# EasyEDA Pro project ProPrj_药盒0.11_2025-04-15.epro, board PCB1_1
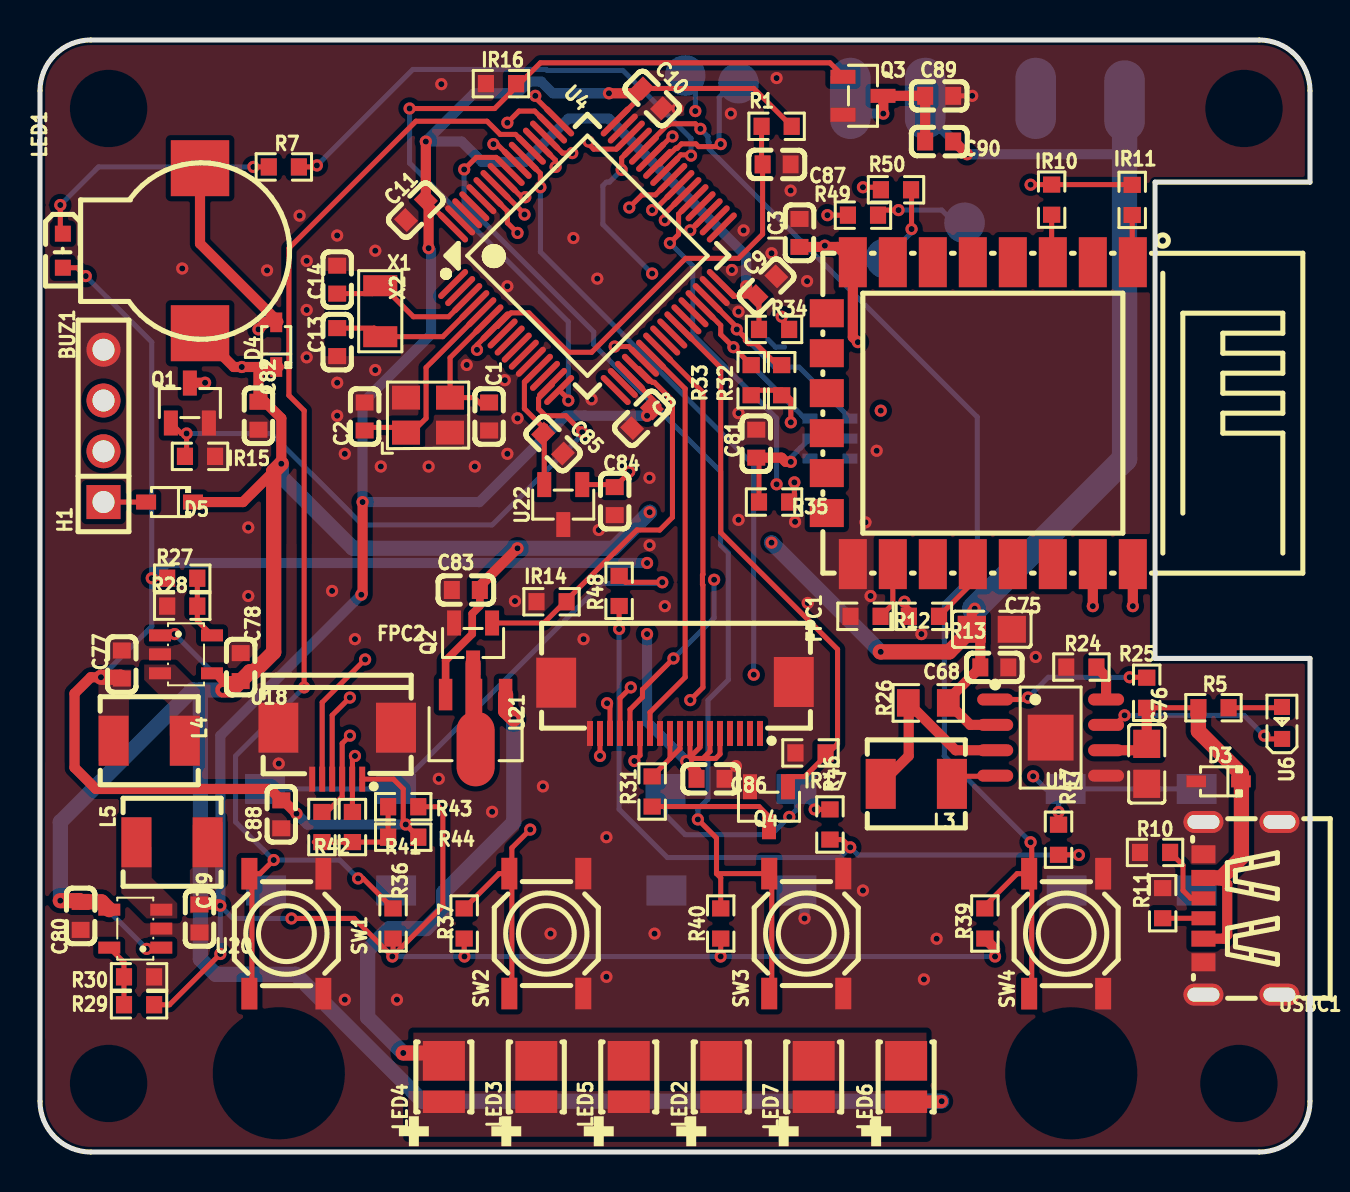
[diagram p7: board, top side]
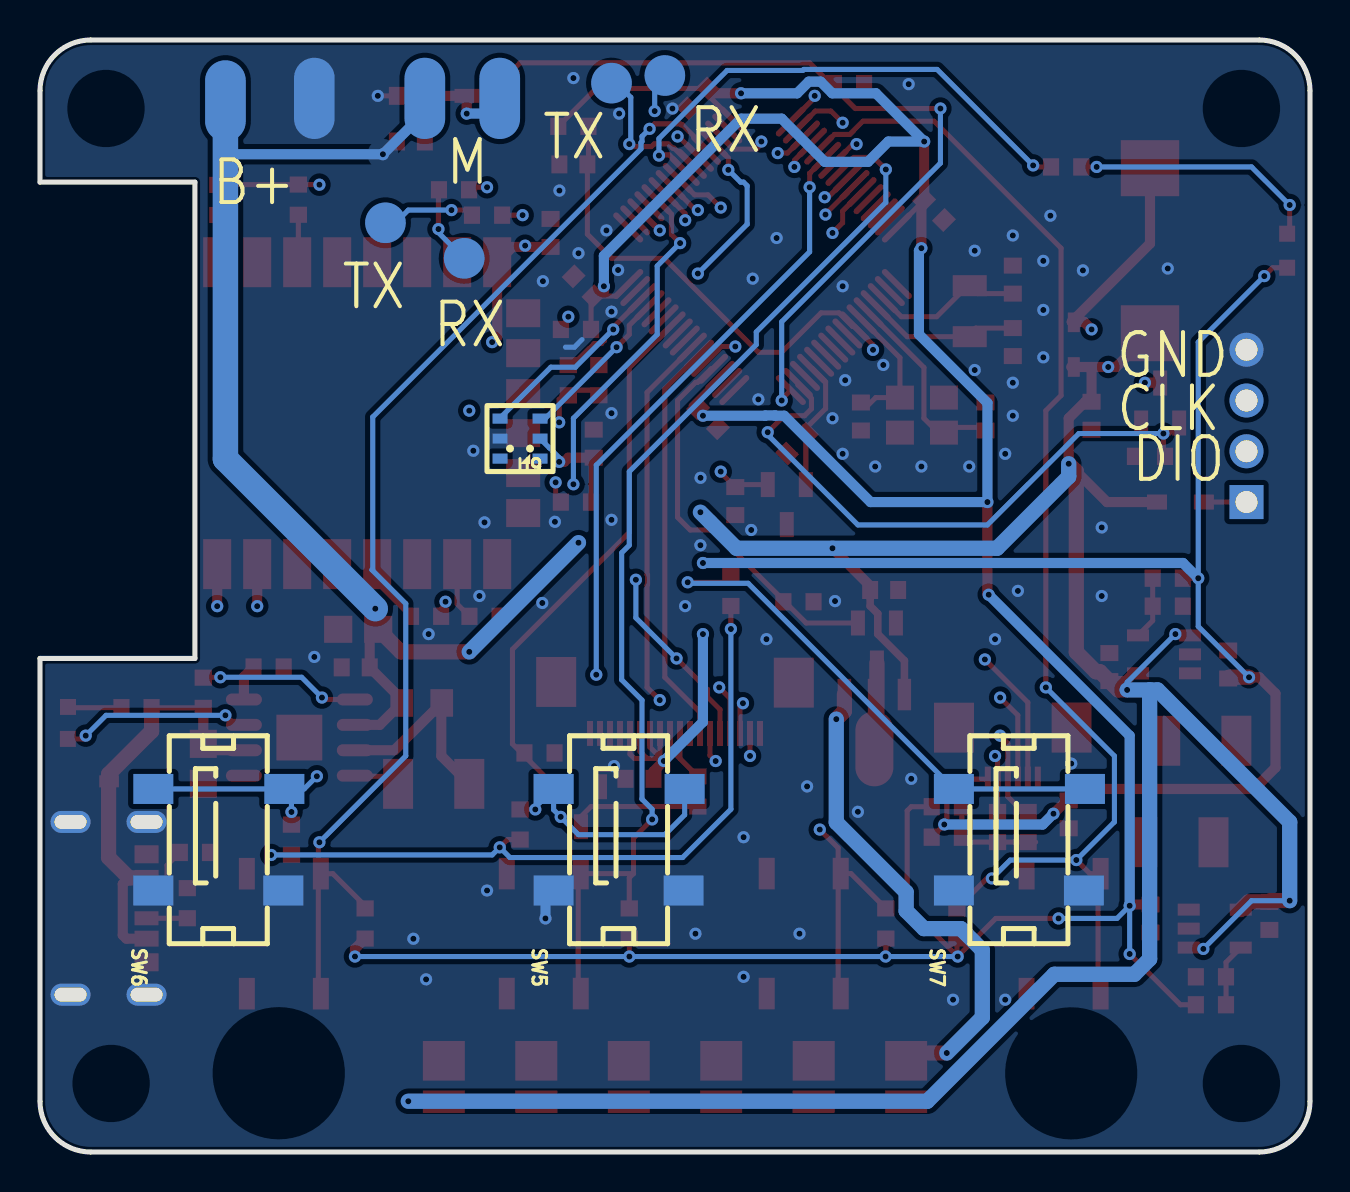
[diagram p8: board, bottom side, seen from below]

Outline 63.5 x 55.63 mm; copper layers: Top Layer, Inner1, Inner2, Bottom Layer. Coordinates in mm from the lower left corner of the outline.
Outline path: 0,53.09 0,2.54 arc(0.74,0.74) 2.54,0 60.96,0 arc(62.76,0.74) 63.5,2.54 63.5,24.69 55.75,24.69 55.75,48.51 63.5,48.51 63.5,53.09 arc(62.76,54.88) 60.96,55.63 2.54,55.63 arc(0.74,54.88) 0,53.09
Stack: Top Layer 0.035mm 外层铜厚1oz / Dielectric1 0.2104mm 7628 RC49% 8.6mil / Inner1 0.0152mm 内层铜厚 / Dielectric2 1.065mm 1.1mm H/HOZ Copper / Inner2 0.0152mm 内层铜厚 / Dielectric3 0.2104mm 7628 RC49% 8.6mil / Bottom Layer 0.035mm 外层铜厚1oz

## Design rules (mm)
template: 自定义配置
spacing copperThickness1oz (default): track to track 0.102, other pairs 0.152 to 0.3
spacing copperThickness2oz: track to track 0.203, other pairs 0.152 to 0.3
track width copperThickness1oz (default): min 0.127, default 0.254, max 2.54
track width copperThickness2oz: min 0.203, default 0.254, max 2.54
differential pair differentialPair (default): width min 0.127, default 0.254, max 2.54; gap min 0.152, default 0.152
via viaSize (default): diameter min 0.5, default 0.61, max 10; hole min 0.3, default 0.305, max 6.3

## Placement (name value [footprint] x y rotation side)
BUZ1  9032蜂鸣器  [BUZ-SMD_KLJ-90XX-3627]  8 45.08 90 top
C1  22pF  [C0603]  22.46 36.79 90 top
C2  22pF  [C0603]  16.23 36.79 90 top
C8  100nF  [C0603]  30.1 36.7 45 top
C9  100nF  [C0603]  36.32 43.31 225 top
C10  100nF  [C0603]  30.61 52.7 135 top
C11  100nF  [C0603]  18.8 47.12 45 top
C13  22pF  [C0603]  14.86 40.51 90 top
C14  22pF  [C0603]  14.86 43.64 270 top
C68  100nF  [C0603]  47.72 24.24 0 top
C75  10uF  [C0805]  47.59 26.15 180 top
C76  22uF  [C0805]  55.34 19.42 270 top
C77  10uF  [C0603]  4.09 24.39 270 top
C78  10uF  [C0603]  10.03 24.26 270 top
C79  10uF  [C0603]  7.97 11.68 90 top
C80  10uF  [C0603]  2.03 11.81 90 top
C81  100nF  [C0603]  35.81 35.43 270 top
C82  1uF  [C0603]  10.92 36.83 90 top
C83  1uF  [C0603]  21.29 28.11 0 top
C84  1uF  [C0603]  28.74 32.56 90 top
C85  1uF  [C0603]  25.65 35.43 135 top
C86  1uF  [C0603]  33.53 18.67 180 top
C87  100nF  [C0603]  36.83 49.4 180 top
C88  1uF  [C0603]  12.06 16.89 90 top
C89  1uF  [C0603]  44.96 52.83 180 top
C90  100nF  [C0603]  44.96 50.55 180 top
D3  PESD5V0S1BA  [SOD-323_L1.7-W1.3-LS2.5-FD-1]  58.93 18.54 0 top
D4  5819WS  [SOD-323_L1.7-W1.3-LS2.5-FD-1]  11.81 40.39 270 top
D5  1N5819WS  [SOD-323_L1.8-W1.3-LS2.5-RD]  6.48 32.51 180 top
FPC1  FPC-05F-18PH20  [FPC-SMD_18P-P0.50_FPC-05F-18PH20]  31.75 22.22 180 top
FPC2  FPC-05F-6PH20  [FPC-SMD_6P-P0.50_XUNPU_FPC-05F-6PH20]  14.86 19.94 180 top
H1  Header-Male-2.54_1x4  [HDR-TH_4P-P2.54-V-M]  3.17 36.32 90 top
IC3  1uf  [C0603]  37.97 45.97 270 top
IR10  10k  [R0603]  50.58 47.64 270 top
IR11  10k  [R0603]  54.61 47.62 270 top
IR12  10k  [R0603]  41.28 26.8 180 top
IR13  10k  [R0603]  44.2 26.8 180 top
IR14  10k  [R0603]  25.58 27.52 0 top
IR15  10k  [R0603]  8 34.8 180 top
IR16  10k  [R0603]  23.05 53.44 0 top
IR17  10k  [R0603]  38.52 19.96 0 top
L3  4.7uH  [IND-SMD_L4.9-W4.4_MAPM0420F]  43.81 18.41 0 top
L4  2.2uH  [IND-SMD_L4.9-W4.4_MAPM0420F]  5.46 20.57 180 top
L5  2.2uH  [IND-SMD_L4.9-W4.4_MAPM0420F]  6.6 15.49 0 top
LED1  19-217/GHC-YR1S2/3T  [LED0603-R-RD]  1.14 45.08 270 top
LED2  2835  [LED-SMD_L3.5-W2.8_2835]  34.06 3.54 90 top
LED3  2835  [LED-SMD_L3.5-W2.8_2835]  24.82 3.54 90 top
LED4  2835  [LED-SMD_L3.5-W2.8_2835]  20.19 3.54 90 top
LED5  2835  [LED-SMD_L3.5-W2.8_2835]  29.44 3.54 90 top
LED6  2835  [LED-SMD_L3.5-W2.8_2835]  43.31 3.54 90 top
LED7  2835  [LED-SMD_L3.5-W2.8_2835]  38.68 3.54 90 top
NOREF  -  [Pad_e1042]  44.26 52.7 0 top
NOREF#2  -  [Pad_e3204]  46.23 46.48 90 top
NOREF#3  -  [Pad_e611]  32.26 53.85 90 top
NOREF#4  -  [Pad_e279]  49.78 52.7 0 top
NOREF#5  -  [Pad_e3203]  42.29 44.7 90 top
NOREF#6  -  [Pad_e612]  34.93 53.47 90 top
NOREF#7  -  [Pad_e68]  54.23 52.58 0 top
NOREF#8  -  [Pad_e1043]  40.51 52.7 0 top
Q1  SI2300  [SOT-23-3_L2.9-W1.3-P1.90-LS2.4-BR]  7.49 37.46 270 top
Q2  SI2300  [SOT-23-3_L2.9-W1.3-P1.90-LS2.4-BR]  21.65 25.46 90 top
Q3  SI2300  [SOT-23-3_L2.9-W1.3-P1.90-LS2.4-BR]  41.15 52.83 180 top
Q4  SI2300  [SOT-23-3_L2.9-W1.3-P1.90-LS2.4-BR]  36.45 17.27 90 top
R1  10k  [R0603]  36.83 51.31 0 top
R5  1kΩ  [R0603]  58.67 22.22 0 top
R7  10KΩ  [R0603]  12.19 49.28 180 top
R10  5.1kΩ  [R0603]  55.75 14.99 0 top
R11  5.1kΩ  [R0603]  56.13 12.45 270 top
R24  20kΩ  [R0603]  52.07 24.26 0 top
R25  10kΩ  [R0603]  55.34 22.97 270 top
R26  0.5Ω  [R0805]  44.41 22.46 0 top
R27  442kΩ  [R0603]  7.11 28.7 180 top
R28  100kΩ  [R0603]  7.11 27.3 0 top
R29  200kΩ  [R0603]  4.95 7.37 0 top
R30  100kΩ  [R0603]  4.95 8.76 180 top
R31  10Ω  [R0603]  30.61 18.03 270 top
R32  4.7kΩ  [R0603]  37.08 38.61 270 top
R33  4.7kΩ  [R0603]  35.56 38.61 270 top
R34  0  [R0603]  36.7 41.15 180 top
R35  0  [R0603]  36.7 32.51 180 top
R36  10kΩ  [R0603]  17.65 11.43 270 top
R37  10kΩ  [R0603]  21.21 11.43 270 top
R39  10kΩ  [R0603]  47.24 11.43 270 top
R40  10kΩ  [R0603]  34.04 11.43 270 top
R41  2k  [R0603]  15.62 16.26 270 top
R42  2k  [R0603]  14.1 16.26 270 top
R43  0  [R0603]  18.16 17.27 0 top
R44  0  [R0603]  18.16 15.75 0 top
R46  10kΩ  [R0603]  39.5 16.38 270 top
R47  10kΩ  [R0603]  50.93 15.62 270 top
R48  10kΩ  [R0603]  28.96 28.07 270 top
R49  0  [R0603]  41.15 46.86 0 top
R50  0  [R0603]  42.8 48.13 0 top
SW1  TS-1076S-A6B2  [SW-SMD_4P-L5.2-W5.2-P3.70-LS6.4]  12.32 10.92 90 top
SW2  TS-1076S-A6B2  [SW-SMD_4P-L5.2-W5.2-P3.70-LS6.4]  25.32 10.93 90 top
SW3  TS-1076S-A6B2  [SW-SMD_4P-L5.2-W5.2-P3.70-LS6.4]  38.31 10.93 90 top
SW4  TS-1076S-A6B2  [SW-SMD_4P-L5.2-W5.2-P3.70-LS6.4]  51.31 10.92 90 top
SW5  TM-1618D  [SW-SMD_TM-1618D]  34.54 15.62 90 bottom
SW6  TM-1618D  [SW-SMD_TM-1618D]  54.56 15.62 90 bottom
SW7  TM-1618D  [SW-SMD_TM-1618D]  14.53 15.62 90 bottom
U4  STM32L431RCT6  [LQFP-64_L10.0-W10.0-P0.50-LS12.0-BL]  27.37 44.83 315 top
U6  RED  [LED0603-RD]  62.1 21.46 90 top
U9  AHT30  [MIC-SMD_6P-L3.0-W3.0-P1.00-TL]  39.5 35.69 0 bottom
U17  ME4059ASPG  [SOP-8_L4.9-W3.9-P1.27-LS6.0-BL-EP]  50.53 20.73 270 top
U18  TLV62569DBVR  [SOT-23-5_L3.0-W1.7-P0.95-LS2.8-BR]  7.3 24.89 180 top
U20  TLV62569DBVR  [SOT-23-5_L3.0-W1.7-P0.95-LS2.8-BR]  4.76 11.17 0 top
U21  MEL7135PG-N  [SOT-89-3_L4.5-W2.5-P1.50-LS4.2-BR]  21.78 21.53 90 top
U22  REF3025  [SOT-23-3_L2.9-W1.3-P0.95-LS2.4-BR]  26.16 32.38 90 top
U24  2.4GHz  [WIFIM-SMD_ESP-12F-ESP8266MOD]  46.99 36.96 180 top
USBC1  USB 3.1 C 6PF  [USB-C-SMD_TYPE-C-USB-13]  60.07 12.19 90 top
X1  8MHz  [OSC-SMD_4P-L3.2-W2.5-BL]  19.4 36.86 0 top
X2  -  [OSC-SMD_L3.2-W1.5]  17.01 42.06 270 top

## Footprints (pads in the part's own frame, mm; a bottom-side part is the same pattern mirrored in y, then rotated)
BUZ-SMD_KLJ-90XX-3627
  rect 2.8x2.92 smd: 1(-4.128,0) 2(4.128,0)
C0603
  rect 0.8x0.9 smd: 1(-0.7,0) 2(0.7,0)
C0805
  rect 1.41x1.35 smd: 1(-1,0) 2(1,0)
FPC-SMD_6P-P0.50_XUNPU_FPC-05F-6PH20
  rect 0.3x1.25 smd: 1(-1.25,1.288) 2(-0.75,1.288) 3(-0.25,1.288) 4(0.25,1.288) 5(0.75,1.288) 6(1.25,1.288)
  rect 2x2.5 smd: 7(2.94,-1.288) 8(-2.94,-1.288)
FPC-SMD_18P-P0.50_FPC-05F-18PH20
  rect 0.3x1.25 smd: 1(-4.25,1.288) 2(-3.75,1.288) 3(-3.25,1.288) 4(-2.75,1.288) 5(-2.25,1.288) 6(-1.75,1.288) 7(-1.25,1.288) 8(-0.75,1.288) 9(-0.25,1.288) 10(0.25,1.288) 11(0.75,1.288) 12(1.25,1.288) 13(1.75,1.288) 14(2.25,1.288) 15(2.75,1.288) 16(3.25,1.288) 17(3.75,1.288) 18(4.25,1.288)
  rect 2x2.5 smd: 19(-5.94,-1.288) 20(5.94,-1.252)
HDR-TH_4P-P2.54-V-M
  rect 1.7x1.7 hole 1.1: 1(-3.81,0)
  round 1.7 hole 1.1: 2(-1.27,0) 3(1.27,0) 4(3.81,0)
IND-SMD_L4.9-W4.4_MAPM0420F
  rect 1.5x2.5 smd: 1(-1.78,0) 2(1.78,0)
LED0603-R-RD
  rect 0.8x0.8 smd: 1(0.851,0) 2(-0.851,0)
LED0603-RD
  rect 0.8x0.8 smd: 1(-0.799,-0.004) 2(0.799,0.004)
LED-SMD_L3.5-W2.8_2835
  rect 1.12x2.1 smd: 1(-1.025,0)
  rect 1.98x2.1 smd: 2(1.025,0)
LQFP-64_L10.0-W10.0-P0.50-LS12.0-BL
  oval 0.3x2 smd: 1(-3.75,-5.75) 2(-3.25,-5.749) 3(-2.75,-5.75) 4(-2.25,-5.75) 5(-1.75,-5.75) 6(-1.25,-5.75) 7(-0.75,-5.75) 8(-0.25,-5.75) 9(0.25,-5.75) 10(0.75,-5.75) 11(1.25,-5.75) 12(1.75,-5.75) 13(2.25,-5.75) 14(2.75,-5.75) 15(3.25,-5.749) 16(3.75,-5.75) 33(3.75,5.75) 34(3.25,5.749) 35(2.75,5.75) 36(2.25,5.75) 37(1.75,5.75) 38(1.25,5.75) 39(0.75,5.75) 40(0.25,5.75) 41(-0.25,5.75) 42(-0.75,5.75) 43(-1.25,5.75) 44(-1.75,5.75) 45(-2.25,5.75) 46(-2.75,5.75) 47(-3.25,5.749) 48(-3.75,5.75)
  oval 2x0.3 smd: 17(5.75,-3.75) 18(5.749,-3.25) 19(5.75,-2.75) 20(5.75,-2.25) 21(5.75,-1.75) 22(5.75,-1.25) 23(5.75,-0.75) 24(5.75,-0.25) 25(5.75,0.25) 26(5.75,0.75) 27(5.75,1.25) 28(5.75,1.75) 29(5.75,2.25) 30(5.75,2.75) 31(5.749,3.25) 32(5.75,3.75) 49(-5.75,3.75) 50(-5.749,3.25) 51(-5.75,2.75) 52(-5.75,2.25) 53(-5.75,1.75) 54(-5.75,1.25) 55(-5.75,0.75) 56(-5.75,0.25) 57(-5.75,-0.25) 58(-5.75,-0.75) 59(-5.75,-1.25) 60(-5.75,-1.75) 61(-5.75,-2.25) 62(-5.75,-2.75) 63(-5.749,-3.25) 64(-5.75,-3.75)
MIC-SMD_6P-L3.0-W3.0-P1.00-TL
  rect 0.75x0.5 smd: 1(-1,1) 2(-1,0) 3(-1,-1) 4(1,-1) 5(1,0) 6(1,1)
OSC-SMD_4P-L3.2-W2.5-BL
  rect 1.4x1.2 smd: 1(-1.1,-0.875) 2(1.1,-0.875) 3(1.1,0.875) 4(-1.1,0.875)
OSC-SMD_L3.2-W1.5
  rect 1.05x1.7 smd: 1(-1.275,0) 2(1.275,0)
Pad_e68
  oval 2.032x4.064 smd far side: 1(0,0)
Pad_e279
  oval 2.032x4.064 smd far side: 1(0,0)
Pad_e611
  round 2.032 smd far side: 1(0,0)
Pad_e612
  round 2.032 smd far side: 2(0,0)
Pad_e1042
  oval 2.032x4.064 smd far side: 1(0,0)
Pad_e1043
  oval 2.032x4.064 smd far side: 1(0,0)
Pad_e3203
  round 2.032 smd far side: 2(0,0)
Pad_e3204
  round 2.032 smd far side: 2(0,0)
R0603
  rect 0.806x0.864 smd: 1(-0.753,0) 2(0.753,0)
R0805
  rect 1.133x1.377 smd: 1(-1,0) 2(1,0)
SOD-323_L1.7-W1.3-LS2.5-FD-1
  rect 0.985x0.6 smd: 1(-1.117,0) 2(1.117,0)
SOD-323_L1.8-W1.3-LS2.5-RD
  rect 1x0.75 smd: 1(-1.173,0) 2(1.173,0)
SOP-8_L4.9-W3.9-P1.27-LS6.0-BL-EP
  oval 0.6x1.8 smd: 1(-1.905,-2.772) 2(-0.635,-2.772) 3(0.635,-2.772) 4(1.905,-2.772) 5(1.905,2.772) 6(0.635,2.772) 7(-0.635,2.772) 8(-1.905,2.772)
  rect 2.29x2.29 smd: 9(0,0)
SOT-23-3_L2.9-W1.3-P0.95-LS2.4-BR
  rect 1.25x0.7 smd: 1(1,-0.95) 2(1,0.95) 3(-1,0)
SOT-23-3_L2.9-W1.3-P1.90-LS2.4-BR
  rect 1.25x0.7 smd: 1(1,-0.95) 2(1,0.95) 3(-1,0)
SOT-23-5_L3.0-W1.7-P0.95-LS2.8-BR
  rect 1.1x0.6 smd: 1(1.3,-0.95) 2(1.3,0) 3(1.3,0.95) 4(-1.3,0.95) 5(-1.3,-0.95)
SOT-89-3_L4.5-W2.5-P1.50-LS4.2-BR
  rect 1.575x0.672 smd: 1(1.356,-1.5) 3(1.356,1.5)
  custom 5.377x1.9 smd: 2(-1.356,0)
SW-SMD_4P-L5.2-W5.2-P3.70-LS6.4
  rect 1.58x0.8 smd: 1(-3,1.85) 2(3,1.85) 3(-3,-1.85) 4(3,-1.85)
SW-SMD_TM-1618D
  rect 1.5x2 smd: 1(-2.54,3.276) 2(-2.54,-3.224) 3(2.54,3.276) 4(2.54,-3.276)
USB-C-SMD_TYPE-C-USB-13
  oval 1.1x2 hole 0.7x1.6: 1(-4.32,1.899) 2(-4.32,-1.901) 3(4.32,-1.901) 4(4.32,1.899)
  rect 0.7x1.2 smd: A5(-0.5,1.897) B5(0.5,1.897)
  rect 0.8x1.2 smd: A9(-1.52,1.899) B9(1.52,1.901)
  rect 0.9x1.2 smd: A12(-2.7,1.899) B12(2.7,1.899)
WIFIM-SMD_ESP-12F-ESP8266MOD
  rect 1.4x2.5 smd: 1(-7.651,-7.551) 2(-5.651,-7.551) 3(-3.651,-7.551) 4(-1.651,-7.551) 5(0.349,-7.551) 6(2.349,-7.551) 7(4.349,-7.551) 8(6.349,-7.551) 9(6.349,7.548) 10(4.349,7.55) 11(2.349,7.551) 12(0.349,7.551) 13(-1.651,7.55) 14(-3.651,7.551) 15(-5.651,7.551) 16(-7.651,7.551)
  rect 1.7x1.4 smd: 17(7.651,-5) 18(7.649,-3.002) 19(7.649,-1.004) 20(7.649,0.998) 21(7.649,2.997) 22(7.651,4.997)

## Nets
As in the schematic, except:
GND: C1.1 C2.2 C8.1 C9.1 C10.1 C11.1 C13.1 C14.1 C68.2 C75.1 C76.2 C77.1 C78.1 C79.1 C80.1 C81.1 C82.1 C83.1 C84.1 C85.1 C86.1 C87.1 C88.1 C89.1 D3.1 FPC1.11 FPC1.18 FPC1.19 FPC1.20 FPC2.6 FPC2.7 FPC2.8 H1.4 IC3.1 IR12.2 IR14.1 IR15.1 IR16.1 IR17.1 NOREF#4.1 Q1.2 Q2.2 Q3.2 Q4.2 R10.1 R11.1 R24.1 R28.1 R30.1 SW1.3 SW1.4 SW2.3 SW2.4 SW3.3 SW3.4 SW4.3 SW4.4 SW5.1 SW5.2 SW6.1 SW6.2 SW7.1 SW7.2 U4.12 U4.18 U4.31 U4.47 U4.60 U4.63 U9.5 U17.5 U17.9 U18.2 U20.2 U22.3 U24.9 USBC1.1 USBC1.2 USBC1.3 USBC1.4 USBC1.A12 USBC1.B12 X1.2 X1.4
BAT+: BUZ1.1 C68.1 C75.2 C78.2 C80.2 C82.2 C83.2 C84.2 C90.1 D4.2 D5.1 LED2.1 LED3.1 LED4.1 LED5.1 LED6.1 LED7.1 NOREF.1 NOREF#7.1 R26.2 U17.2 U18.1 U18.4 U20.1 U20.4 U21.3 U22.1
PA9: NOREF#6.2 U4.42
PA10: NOREF#3.1 U4.43
$1N34275: C89.2 C90.2 NOREF#8.1 Q3.3
$1N55989: NOREF#2.2 R49.2 U24.16
$1N55993: NOREF#5.2 R50.2 U24.15

Pads without a net: FPC1 1 2 3 4; U4 1; U9 1 6; U24 2 4 5 6 7 11 13 14 17 18 19 20 21 22

## Via types
v1: diameter 0.61, hole 0.305, Top Layer to Bottom Layer, 189 vias

## Routing (per net, layer and track width the routed paths; a pad name or vN(x,y) marks a point on that pad's centre or on a via; arc(x,y) is an arc through that point)
3V3: length 159.5
  Top Layer w0.254: C81.2 35.95,34.6 R35.2 ; 33.15,19.68 33.78,19.68 34,19.9 FPC1.5 ; 33.15,19.68 33.5,20.04 FPC1.6 ; 33.15,19.68 32.44,19.68 v1(32.31,19.56) ; IR13.2 43.63,26.98 43.22,27.39 v1(43.22,27.53) ; v1(2.29,43.81) 1.87,44.23 1.02,44.23 ; FPC2.1 17.67,18.65 18.16,18.16 18.16,16.51 v1(18.29,16.38) 18.29,16.37 R44.2 ; v1(39.24,45.34) 39.24,45.29 39.26,45.27 ; FPC1.8 32.5,19.75 33,20.25 FPC1.7 ; v1(49.53,48.39) 49.53,48.39 IR10.1 54.6,48.39 IR11.1 ; R27.2 v1(5.59,28.7)
  Top Layer w0.508: IC3.2 39.87,45.27 U24.8 40.64,40.77 v1(40.89,40.51) ; C81.2 37.08,34.73 37.29,34.52 v1(37.54,34.52) ; C86.2 32.83,19.04 v1(32.31,19.56) ; v1(12.83,16.92) 12.16,17.59 C88.2 11.5,18.16 2.79,18.16 1.73,19.23 1.73,22.93 2.54,23.75 v1(3.05,23.75)
  Top Layer w0.762: C77.2 4.03,23.75 v1(3.05,23.75)
  Inner1 w0.254: 40.23,29.82 40.67,29.82 42.96,27.53 v1(43.22,27.53)
  Inner1 w0.508: v1(30.35,29.46) v1(30.35,25.91)
  Inner1 w0.762: v1(42.04,37.08) 40.39,35.43 40.39,29.97 39.88,29.46 v1(30.35,29.46)
  Inner2 w0.254: v1(39.24,45.34) 39.62,45.34 42.67,48.39 v1(49.53,48.39)
  Inner2 w0.508: v1(40.89,40.51) 42.04,39.37 v1(42.04,37.08) 39.48,34.52 v1(37.54,34.52)
  Bottom Layer w0.254: v1(3.05,23.75) 5.59,26.29 v1(5.59,28.7) 5.59,40.51 v1(2.29,43.81) ; v1(37.54,34.52) 37.54,34.73 37.84,35.03 37.84,35.05 38.01,35.22 38.03,35.22 U9.2
  Bottom Layer w0.508: v1(5.59,28.7) 6.35,29.46 v1(30.35,29.46) ; v1(30.35,25.91) 30.35,21.51 v1(32.31,19.56) ; v1(12.83,16.92) 13.37,16.38 v1(18.29,16.38)
GND: length 3.5
  Top Layer w0.254: C89.1 v1(46.61,52.83)
  Bottom Layer w0.254: 37.23,40.26 36.78,40.26 36.4,40.64
  Bottom Layer w0.508: v1(38.23,11.68) 38.23,12.67 SW5.1
  vias: v1(7.11,44.2) v1(10.41,31.24) v1(10.41,27.81) v1(11.35,44.1) v1(11.94,19.43) v1(12.98,46.84) v1(13.34,44.58) v1(13.34,42.12) v1(13.34,39.75) v1(14.6,28.07) v1(14.86,45.85) v1(14.86,38.48) v1(14.86,36.83) v1(15.24,34.92) v1(15.24,7.62) v1(15.75,25.65) v1(16.76,45.08) v1(16.76,39.12) v1(17.04,34.29) v1(17.85,7.62) v1(19.43,34.29) v1(19.94,18.67) v1(20.07,53.42) v1(21.34,39.37) v1(21.74,34.29) v1(22.61,17.02) v1(23.24,38.61) v1(23.37,43.31) v1(23.37,34.92) v1(23.75,27.56) v1(23.88,36.7) v1(25.15,18.29) v1(25.53,10.92) v1(26.67,45.72) v1(27.18,25.65) v1(27.58,37.65) v1(27.86,43.69) v1(27.94,31.11) v1(28.32,15.75) v1(28.32,8.76) v1(30.47,33.72) v1(30.48,30.35) v1(30.73,10.92) v1(31.24,27.3) v1(31.88,52.2) v1(34.54,51.94) v1(34.59,44.12) v1(34.8,19.3) v1(34.93,42.04) v1(34.93,36.96) v1(34.93,31.62) v1(35.18,46.1) v1(36.58,44.96) v1(36.83,53.72) v1(37.53,48.09) v1(37.75,31.52) v1(38.35,43.56) v1(38.39,27.46) v1(41.15,13.08) v1(41.28,31.5) v1(41.53,27.81) v1(41.83,35.08) v1(44.07,25.91) v1(44.2,8.64) v1(44.83,10.67) v1(49.78,24.77)
1.8: length 171.4
  Top Layer w0.254: R1.2 35.69,53.2 30.11,53.2 ; v1(21.22,9.78) 21.21,9.79 R37.2 ; v1(34.03,9.78) 34.04,9.78 R40.2 ; 29.96,53.05 29.96,52.72 U4.48 ; R34.2 35.95,42.69 35.83,42.81 34.7,42.81 34.09,43.42 ; 30.95,37.34 29.49,38.79 U4.19 ; 17.65,9.82 20.14,12.3 20.14,17.07 19.94,17.27 R43.2 ; 17.65,9.82 R36.2 ; 17.65,9.82 v1(17.62,9.78) 15.71,11.68 v1(12.57,11.68) ; R29.2 6.48,7.37 v1(9.02,9.91) ; 20.65,46.25 19.43,47.47
  Top Layer w0.508: 35.32,43.04 35.31,43.05 v1(35.31,43.31) ; v1(9.02,12.32) 8.95,12.38 C79.2 ; R39.2 47.75,10.17 v1(47.75,9.78) ; v1(16.13,32.51) 16.13,27.94 v1(16.07,27.88) ; v1(28.45,52.96) 29.87,52.96 ; 19.29,47.61 v1(19.29,50.55) ; 19.43,47.47 v1(19.43,45.21)
  Bottom Layer w0.254: v1(47.75,9.78) v1(34.03,9.78) v1(21.22,9.78) v1(17.62,9.78) ; v1(9.02,9.91) v1(9.02,12.32) 9.65,11.68 v1(12.57,11.68)
  Bottom Layer w0.508: v1(16.07,27.88) 9.02,20.83 v1(9.02,12.32) ; v1(30.35,36.83) 27.24,36.83 27.23,36.84 26.75,36.84 26.73,36.83 26.29,36.83 21.97,32.51 v1(16.13,32.51) 16.13,37.48 19.55,40.9 19.55,45.09 v1(19.43,45.21) ; v1(28.45,52.96) 25.64,52.96 25.06,53.54 24.47,53.54 23.89,52.96 21.7,52.96 v1(19.29,50.55) 21.08,50.55 22.1,49.53 24.26,49.53 26.42,51.69 28.45,51.69 35.31,44.83 v1(35.31,43.31)
A1: length 80.9
  Top Layer w0.254: v1(51.94,14.86) 51.93,14.87 R47.2 ; v1(40.51,15.24) 40.12,15.63 R46.2 ; 32.67,47.66 31.93,46.92 31.93,45.9 v1(31.5,45.47) ; R48.2 v1(28.96,26.16)
  Inner2 w0.254: v1(36.83,33.4) 36.96,33.4 39.88,30.48 41.4,30.48 48.13,23.75 50.55,23.75 51.94,22.35 v1(51.94,14.86)
  Bottom Layer w0.254: v1(28.96,26.16) 28.96,17.14 31.37,14.73 40,14.73 v1(40.51,15.24) 40.89,14.86 v1(51.94,14.86) ; v1(36.83,33.4) 36.83,36.7 32.64,40.89 32.64,44.32 v1(31.5,45.47)
A2: length 50.4
  Top Layer w0.254: v1(29.08,49.13) 29.08,49.73 U4.45 ; R46.1 v1(38.74,17.14)
  Inner2 w0.254: v1(37.47,16.76) 37.47,23.75 32.89,28.32 32.89,41.66 v1(30.61,43.94)
  Bottom Layer w0.254: v1(38.74,17.14) 38.74,17.25 SW5.3 37.82,17.12 v1(37.47,16.76) 36.58,15.88 32.26,15.88 31.27,16.86 SW5.4 ; v1(30.61,43.94) 28.14,46.41 28.14,48.33 28.32,48.51 28.47,48.51 v1(29.08,49.13)
A3: length 47.7
  Top Layer w0.254: R47.1 v1(50.93,17.01) ; 32.32,48.02 31.24,46.94 v1(31.24,46.61)
  Inner2 w0.254: v1(49.66,18.8) 35.81,32.64 35.81,41.97 31.24,46.54 v1(31.24,46.61)
  Bottom Layer w0.254: v1(49.66,18.8) 50.29,18.16 SW6.4 ; SW6.4 50.93,17.8 v1(50.93,17.01) ; SW6.4 SW6.3
A4: length 52.9
  Top Layer w0.254: v1(32.51,46.1) 32.53,46.1 U4.35 ; v1(31.12,28.5) 29.28,28.5 R48.1
  Inner2 w0.254: v1(31.12,28.5) 31.12,33.91 29.46,35.56 29.46,40.39 28.45,41.4 28.45,47.37 29.08,48.01 30.8,48.01 32.26,46.55 32.26,46.35 v1(32.51,46.1)
  Bottom Layer w0.254: v1(31.12,28.5) 31.06,28.45 28.09,28.45 SW7.3 SW7.4
BAT+: length 216.2
  Top Layer w0.254: U18.1 6.06,25.91 v1(6.73,25.91) ; U20.1 6,10.16 v1(5.33,10.16) ; v1(29.46,34.04) 29.46,33.99 C84.2 28.61,33.38 U22.1
  Top Layer w0.381: 21.99,27.83 21.99,27.31 21.61,26.93 21.61,25.91 20.28,24.58 20.28,22.88
  Top Layer w0.508: C90.1 45.72,50.55 v1(46.35,49.91) ; BUZ1.1 9.69,39.27 v1(10.09,39.27) 10.94,39.27 ; U17.2 46.51,21.37 R26.2 45.41,22.64 C68.1 47.02,25.72 C75.2 46.59,27.03 v1(46.74,27.18) ; v1(23.88,30.2) 21.99,28.32 C83.2 21.99,27.83 ; 11.68,34.05 10.15,32.51 D5.1 ; C78.2 9.21,23.56 9.02,23.75 ; v1(12.06,34.43) 12.06,36.7 11.24,37.53 C82.2 10.92,39.25 10.94,39.27 ; 11.94,39.27 10.94,39.27
  Top Layer w0.635: LED6.1 45.06,2.51 v1(45.09,2.54)
  Top Layer w0.762: v1(1.02,12.57) 1.97,12.57 C80.2 3.08,12.51 U20.4 ; C75.2 45.46,25.02 v1(42.04,25.02) 42.02,25.02 ; v1(9.14,23.11) 9.59,23.11 C78.2 10.5,24.02 10.7,24.02 11.68,25 11.68,34.05 v1(12.06,34.43)
  Inner1 w0.762: v1(36.58,30.48) 32.13,30.48 29.46,33.15 v1(29.46,34.04)
  Bottom Layer w0.254: v1(6.73,25.91) 9.14,23.49 v1(9.14,23.11) ; v1(1.02,12.57) 2.92,12.57 v1(5.33,10.16)
  Bottom Layer w0.508: 54.1,49.93 54.09,49.91 v1(46.35,49.91) 44.26,52.01 NOREF.1
  Bottom Layer w0.762: 8.02,23.11 8.02,9.65 8.78,8.89 12.78,8.89 19.13,2.54 v1(45.09,2.54) ; 8.02,23.11 v1(9.14,23.11) ; 8.02,23.11 7.62,23.11 1.02,16.51 v1(1.02,12.57) ; v1(36.58,30.48) v1(42.04,25.02) ; v1(12.06,34.43) 12.06,33.78 15.65,30.2 v1(23.88,30.2) 28.68,30.2 v1(30.48,32)
  Bottom Layer w1.27: NOREF#7.1 54.23,34.67 v1(46.74,27.18)
BEEP: length 29.9
  Top Layer w0.254: v1(7.33,35.94) 7.33,34.88 IR15.2 ; v1(27.11,36) 26.29,36.83 25.27,36.83 24.93,37.18 24.93,37.69 25.6,38.37 25.6,38.47 ; Q1.1 7.07,35.94 7.11,35.94
  Bottom Layer w0.254: v1(27.11,36) 27,35.89 27,35.76 22.61,31.37 16.13,31.37 11.56,35.94 v1(7.33,35.94)
BL: length 27.3
  Top Layer w0.254: 37.4,18.78 38.24,18.78 39.88,20.41 39.88,25.15 34.04,30.99 34.04,39.23 U4.26
DENG: length 19.5
  Top Layer w0.254: 22.6,26.46 25.19,26.46 29.84,31.11 30.99,31.11 31.62,31.75 31.62,37.6 30.72,38.5 30.62,38.5 29.95,39.18 U4.20
K1: length 55.1
  Top Layer w0.254: R40.1 34.04,13.72 33.82,13.93 ; v1(32.89,16.64) 33.82,15.7 33.82,13.93 ; 33.82,13.93 36.59,13.93 36.59,7.93 ; v1(21.21,49.15) 21.81,49.75 22.81,49.75 U4.56
  Bottom Layer w0.254: v1(21.21,49.15) 21.21,47.5 27.69,41.02 27.69,40.39 34.04,34.04 34.04,30.35 34.42,29.97 34.42,23.62 33.4,22.61 33.4,17.65 32.89,17.14 v1(32.89,16.64)
K2: length 49.9
  Top Layer w0.254: 23.59,13.93 22.95,13.93 R37.1 ; 23.59,13.93 23.59,15.21 v1(24.51,16.13) ; 23.59,13.93 23.59,7.93 ; v1(22.67,50.42) 22.85,50.42 23.84,49.43
  Inner2 w0.254: v1(24.51,16.13) 25.78,17.4 25.78,48.39 23.88,50.29 22.73,50.29
K3: length 62.8
  Top Layer w0.254: 10.6,7.92 10.6,13.92 11,13.92 v1(11.68,14.6) ; v1(13.21,23.24) 13.21,37.08 12.45,37.85 12.45,45.21 18.8,51.56 22.35,51.56 23.01,50.9 23.78,50.9 24.54,50.14 ; v1(15.91,13.68) 16.15,13.68 R36.1
  Bottom Layer w0.254: v1(13.21,23.24) 9.78,19.81 9.78,16.51 v1(11.68,14.6) 14.99,14.6 v1(15.91,13.68)
K4: length 58.2
  Top Layer w0.254: 49.59,13.92 48.86,13.92 47.37,12.44 47.37,12.31 R39.1 ; 49.59,13.92 49.59,15.44 v1(49.53,15.49) ; 49.59,13.92 49.59,7.92 ; U4.44 30.2,50.2 31.38,51.38 31.45,51.38 31.5,51.43 32.77,51.43 v1(33.02,51.18)
  Bottom Layer w0.254: v1(49.53,15.49) 45.21,19.81 45.21,27.43 46.9,29.12 46.86,29.16 46.86,36.77 33.45,50.18 33.45,50.49 33.4,50.55 33.4,50.8 v1(33.02,51.18)
MOT: length 41.5
  Top Layer w0.254: v1(18.48,52.2) 22.73,52.2 25.02,54.48 39.5,54.48 40.15,53.83 Q3.1 ; v1(26.42,37.59) 26.42,37.66 U4.16
  Bottom Layer w0.254: v1(26.42,37.59) 26.42,41.53 18.48,49.47 v1(18.48,52.2)
PA5: length 21.5
  Top Layer w0.254: v1(28.73,40.29) 29.44,40.29 U4.21 ; FPC1.16 28.5,22.3 v1(28.35,22.45)
  Inner2 w0.254: v1(28.35,22.45) 28.57,22.67 28.57,25.72 28.37,25.92 28.37,26.4 28.57,26.61 28.57,40.13 v1(28.73,40.29)
PA6: length 20.4
  Top Layer w0.254: FPC1.12 30.5,21.99 32.26,23.75 32.26,38.18 U4.22
PA7: length 24.5
  Top Layer w0.254: 30.91,40.24 33.15,38 33.15,28.89 33.12,28.87 33.12,28.38 33.15,28.36 33.15,23.24 v1(32.51,22.61) ; v1(29.72,19.56) 30,19.84 FPC1.13
  Inner2 w0.254: v1(32.51,22.61) 29.72,19.81 v1(29.72,19.56)
PA8: length 25.5
  Top Layer w0.254: U4.41 31.26,49.1 32.04,49.88 32.52,49.88 v1(32.55,49.84) ; R7.1 13.84,49.28
  Bottom Layer w0.254: v1(13.84,49.35) 18.64,54.15 25.31,54.15 25.36,54.1 29.15,54.1 32.55,50.7 v1(32.55,49.84)
PA9: length 7.1
  Top Layer w0.254: v1(34.04,50.42) 33.91,50.29 32.93,50.29 32.79,50.43 32.08,50.43 31.87,50.22 31.79,50.22 31.01,49.43 30.91,49.43
  Bottom Layer w0.254: 34.73,53.53 33.96,52.76 33.96,50.49 v1(34.04,50.42)
PA10: length 4.7
  Top Layer w0.254: 31.5,50.67 31.44,50.67 U4.43
  Inner2 w0.254: v1(32.77,52.07) 32.77,51.94 v1(31.62,50.8)
  Bottom Layer w0.254: 32.32,53.53 32.77,53.09 v1(32.77,52.07)
PA15: length 40.7
  Top Layer w0.254: v1(23.37,51.49) 23.95,52.07 24.73,52.07 U4.50 ; v1(16.26,24.64) 14.11,22.49 FPC2.5
  Inner2 w0.254: v1(23.37,51.49) 21.26,51.49 18.41,48.64 18.41,26.8 v1(16.26,24.64)
PB5: length 36.3
  Top Layer w0.254: 23.13,48.72 24.09,47.76 v1(24.27,47.76) ; FPC2.4 14.61,21.85 v1(15.49,22.73)
  Inner2 w0.254: v1(15.49,22.73) 18.29,22.73 20.32,24.77 20.32,43.81 v1(24.27,47.76)
PB6: length 38.3
  Top Layer w0.254: U4.58 24.13,47.01 24.13,46.99 ; R41.1 15.62,18.64 FPC2.2 15.62,18.66 15.62,19.68 v1(15.75,19.81)
  Inner2 w0.254: v1(15.75,19.81) 20.32,19.81 24.46,23.95 24.46,46.66 v1(24.23,46.89)
PB7: length 37.7
  Top Layer w0.254: v1(23.88,45.97) 23.37,46.48 23.37,47.07 U4.59 ; v1(15.5,20.83) 15.11,20.44 FPC2.3 15.11,17.78 14.34,17.01 R42.1
  Inner2 w0.254: v1(23.88,45.97) 22.48,44.58 22.48,24.51 18.8,20.83 v1(15.5,20.83)
PB10: length 9.2
  Top Layer w0.254: 35.56,39.62 35.31,39.62 v1(34.67,40.26) 34.04,40.89 34.04,41.35 U4.29
  Bottom Layer w0.254: U9.3 38.24,36.69 v1(34.67,40.26)
PB11: length 12.7
  Top Layer w0.254: U4.30 34.84,41.26 v1(34.84,41.15) 35.27,40.72 35.27,40.6 35.43,40.44 35.79,40.44 36.87,39.36 R32.1
  Bottom Layer w0.254: v1(34.84,41.15) 36.73,39.26 37.96,39.26 40.5,36.72 U9.4
PC8: length 31.1
  Top Layer w0.254: v1(30.61,47.12) 30.72,47.12 U4.39 ; FPC1.14 29.5,22.13 30.12,22.76 30.12,23.14 v1(31.67,24.69)
  Inner2 w0.254: v1(33.71,28.63) 33.71,42.24 30.61,45.34 v1(30.61,47.12)
  Bottom Layer w0.254: v1(33.71,28.63) 33.71,26.72 v1(31.67,24.69)
PC9: length 31.3
  Top Layer w0.254: v1(29.46,47.24) 30.1,47.88 30.77,47.88 U4.40 ; FPC1.15 29,22.7 v1(29.54,23.24)
  Inner2 w0.254: v1(29.54,23.24) 29.54,24.21 31.88,26.54 31.88,39.12 29.46,41.53 v1(29.46,47.24)
PD2: length 41.2
  Top Layer w0.254: FPC1.17 v1(28,19.81) ; U4.54 25.02,48.95 v1(25.02,48.26)
  Inner2 w0.254: v1(28,19.81) 32.06,23.88 v1(35.69,23.88)
  Bottom Layer w0.254: v1(35.69,23.88) 35.69,34.36 25.02,45.03 v1(25.02,48.26)
POWER_IN: length 21.5
  Top Layer w0.254: R5.1 57.92,22.22 R25.2
  Top Layer w0.508: USBC1.A9 59.18,10.67 59.36,10.85 59.36,13.4 59.05,13.71 ; U17.6 55.01,20.1 C76.1 R25.2
  Top Layer w0.762: USBC1.B9 59.05,13.71 60.07,14.73 60.07,18.9 57.92,21.05 R5.1
REF: length 6.6
  Top Layer w0.254: U4.13 24.87,39.18 24.22,38.53 24.22,37.18 25.16,36.25 ; 25.29,36.31 25.21,36.23 U22.2
RST: length 23.9
  Top Layer w0.254: v1(21.85,40.13) 21.85,40.37 U4.7 22.88,41.3 23.55,41.97 24.45,41.97 26.42,40 27.58,40 32.28,44.7 34.93,44.7 36.13,45.91 C87.2 36.08,49.46 R1.1
RXD: length 17.9
  Top Layer w0.254: v1(26.61,49.97) 26.13,49.97 U4.51 ; R50.1 41.92,48.26 v1(41.15,48.26)
  Inner2 w0.254: v1(26.61,49.97) 27.18,49.97 27.19,49.96 27.67,49.96 27.68,49.97 30.55,49.97 31.59,48.93 40.48,48.93 v1(41.15,48.26)
SWCLK: length 29.8
  Top Layer w0.254: v1(24.76,52.83) 24.76,52.74 U4.49
  Inner2 w0.254: 3.17,37.59 3.17,37.86 18.15,52.83 v1(24.76,52.83)
SWDIO: length 35.1
  Top Layer w0.254: v1(27.43,50.55) 27.43,50.42 27.69,50.16 28.81,50.16 U4.46
  Inner2 w0.254: H1.2 11.94,43.81 11.94,44.83 19.18,52.07 25.91,52.07 v1(27.43,50.55)
TXD: length 17.2
  Top Layer w0.254: R49.1 v1(39.37,46.86) ; v1(25.78,49.28) 25.78,49.47 25.77,49.47 25.77,49.61 U4.52
  Inner2 w0.254: v1(39.37,46.86) 38.86,47.37 32.77,47.37 31.62,48.51 26.54,48.51 v1(25.78,49.28)
TXIN: length 7.7
  Top Layer w0.254: 14.81,42.94 16.62,42.94 17.01,43.33 17.12,43.33 18.67,41.78 20.43,41.78 U4.3
TXOUT: length 7.8
  Top Layer w0.254: 14.86,41.09 14.99,41.21 16.71,41.21 17.01,40.91 X2.2 20.14,40.78 U4.4
XIN: length 9.5
  Top Layer w0.254: U4.5 19.3,39.24 19.3,36.7 18.59,35.99 X1.1 18.04,36.25 16.61,36.25
XOUT: length 6.6
  Top Layer w0.254: 22.17,37.28 21.71,37.74 X1.3 20.5,39.73 U4.6
$1N2367: length 2.1
  Top Layer w0.254: D5.2 3.17,32.51
$1N3753: length 3.4
  Top Layer w0.254: USBC1.B5 57.54,12.69 57.15,13.08 57.15,14.34 R10.2
$1N3756: length 2
  Top Layer w0.254: R11.2 USBC1.A5
$1N3989: length 9.5
  Top Layer w0.254: U6.1 61.38,20.66 v1(61.21,20.83) ; U17.7 53.75,21.37 v1(54.23,21.84)
  Bottom Layer w0.254: v1(61.21,20.83) 60.2,21.84 v1(54.23,21.84)
$1N3995: length 2.7
  Top Layer w0.254: U6.2 62.06,22.22 R5.2
$1N8286: length 1.8
  Top Layer w0.508: R24.2 53.3,23.78 U17.8
$1N8329: length 8
  Top Layer w0.254: v1(54.48,23.75) 55.31,23.75 R25.1 ; U17.1 49.31,22.64 v1(49.4,22.73)
  Bottom Layer w0.254: v1(54.48,23.75) 50.42,23.75 v1(49.4,22.73)
$1N9596: length 3.2
  Top Layer w0.254: R27.1 R28.2 7.87,26.58 8.6,25.84
$1N9921: length 3.2
  Top Layer w0.254: U20.5 4.2,9.49 R30.2 R29.1
$1N10265: length 15
  Top Layer w0.508: v1(8.25,38.48) 7.51,38.48 Q1.3 ; BUZ1.2 8,45.44 11.91,41.53 11.3,41.53 v1(10.92,41.15)
  Inner2 w0.508: v1(10.92,41.15) v1(8.25,38.48)
$1N14140: length 6
  Top Layer w0.254: 36.45,16.78 35.95,17.28 R31.2
$1N14527: length 14.5
  Top Layer w0.254: v1(37.08,41.78) 37.08,41.66 37.46,41.28 R34.1 ; v1(37.54,36.5) 37.54,37.65 37.08,38.11 35.56,38.11 ; v1(37.72,33.5) 37.72,32.77 R35.1
  Inner2 w0.254: v1(37.72,33.5) 36.96,34.26 36.96,34.76 37.08,34.89 37.08,36.96 ; 37.08,36.96 v1(37.54,36.5) ; 37.08,36.96 v1(37.08,41.78)
$1N17677: length 9.9
  Top Layer w0.508: L3.1 43.43,19.81 43.43,22.44 ; U17.3 45.78,20.1 43.43,22.44 ; 43.43,22.44 R26.1
$1N17682: length 2.3
  Top Layer w0.254: U17.4 47.38,18.83 47.35,18.8 45.98,18.8 L3.2
$1N18024: length 5.3
  Top Layer w0.254: 13.72,15.5 R41.2 17.16,15.5 R44.1 R43.1
$1N33567: length 12.6
  Top Layer w0.254: R7.2 v1(10.67,49.28) ; 1.02,45.94 v1(1.02,47.37)
  Bottom Layer w0.254: v1(10.67,49.28) 2.92,49.28 v1(1.02,47.37)
$1N34275: length 7.3
  Top Layer w0.508: v1(42.16,51.94) 42.16,52.82 Q3.3 C89.2 C90.2
  Bottom Layer w0.508: NOREF#8.1 41.28,51.94 v1(42.16,51.94)
$1N55778: length 2.4
  Top Layer w0.254: IR10.2 50.58,44.57 U24.3
$1N55803: length 2.4
  Top Layer w0.254: U24.1 54.61,44.54 IR11.2
$1N55922: length 2.9
  Top Layer w0.254: U24.10 42.64,27.41 IR12.1
$1N55924: length 3.3
  Top Layer w0.254: IR13.1 46.64,28.49 U24.12
$1N55989: length 34.4
  Top Layer w0.254: R49.2 42.16,47.12 v1(42.93,47.12)
  Top Layer w0.508: U24.16 v1(54.64,27.3)
  Inner2 w0.254: v1(42.93,47.12) 47.12,47.12 54.64,39.59 v1(54.64,27.3)
  Bottom Layer w0.254: v1(42.93,47.12) 45.09,47.12 46.04,46.16 46.35,46.48 NOREF#2.2
$1N55993: length 28.7
  Top Layer w0.254: R50.2 43.58,48.11 v1(43.58,46.17)
  Top Layer w0.508: U24.15 v1(52.64,27.3)
  Inner2 w0.254: v1(43.58,46.17) 52.64,37.1 v1(52.64,27.3)
  Bottom Layer w0.254: v1(43.58,46.17) 43.58,45.99 NOREF#5.2
$1N56002: length 4
  Top Layer w0.254: FPC1.10 31.5,19.68 ; 31.5,19.68 R31.1 ; 31.5,19.68 32,20.18 FPC1.9
$1N56193: length 4.3
  Top Layer w0.762: 21.78,20.17 21.65,20.3 Q2.3
$1N56200: length 23.8
  Top Layer w0.762: v1(23.69,21.65) 23.28,22.06 23.28,22.88 ; v1(18.16,4.95) 19.05,4.95
  Bottom Layer w0.762: v1(18.16,4.95) 16.38,6.73 16.38,10.1 17.46,11.18 19.3,11.18 20.19,12.06 20.19,13 23.69,16.49 v1(23.69,21.65)

## Copper pours and planes (outline as drawn; the poured copper is in the pictures)
3V3 on Top Layer: 2.92,24.13 4.57,24.13 4.57,19.43 2.92,19.43
GND on Top Layer: -2.03,19.56 11.3,19.56 11.3,5.59 -2.03,5.59
GND on Top Layer: -2.41,57.91 66.29,57.91 66.29,-3.3 -2.41,-3.3
GND on Top Layer: 14.1,16.51 0.76,16.51 0.76,30.48 14.1,30.48
GND on Bottom Layer: -6.98,59.69 70.61,59.69 70.61,-6.35 -6.98,-6.35
GND on Inner1: -7.62,59.82 72.9,59.82 72.9,-1.78 -7.62,-1.78
GND on Inner2: -10.16,70.61 82.17,70.61 82.17,-15.49 -10.16,-15.49
1.8 on Top Layer: 7.49,16.64 9.14,16.64 9.14,11.94 7.49,11.94
BAT+ on Top Layer: 18.41,3.05 44.32,3.05 44.32,0.76 18.41,0.76
$1N8901 on Top Layer: 5.21,24.38 8,24.38 8,19.3 5.21,19.3
$1N9902 on Top Layer: 4.06,16.76 6.86,16.76 6.86,11.68 4.06,11.68
$1N56200 on Top Layer: 18.67,5.97 44.32,5.97 44.32,3.56 18.67,3.56

## Text on the board
Bottom Silkscreen Layer: DIO | CLK | GND | RX | TX | B+ | M
